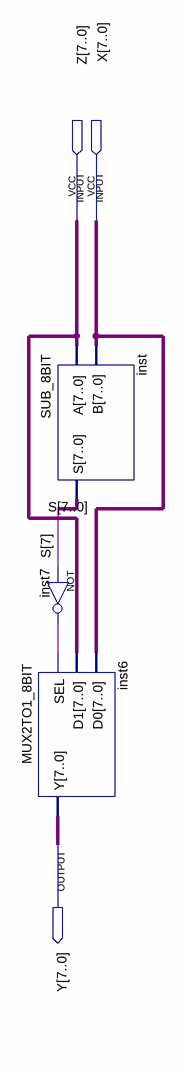
[diagram p0: schematic sheet]
// Quartus schematic MAX_8BIT.bdf as structural Verilog: 3 symbols, 3 pins
module MAX_8BIT (
  input  [7:0] Z,
  input  [7:0] X,
  output [7:0] Y
);

  wire inst7_out;
  wire [7:0] S;

  MUX2TO1_8BIT inst6 (.SEL(inst7_out), .D1(Z), .D0(X), .Y(Y));
  SUB_8BIT inst (.A(Z), .B(X), .S(S));
  not inst7 (inst7_out, S[7]);
endmodule
